# Altium schematic sheet Top.SchDoc
size A4
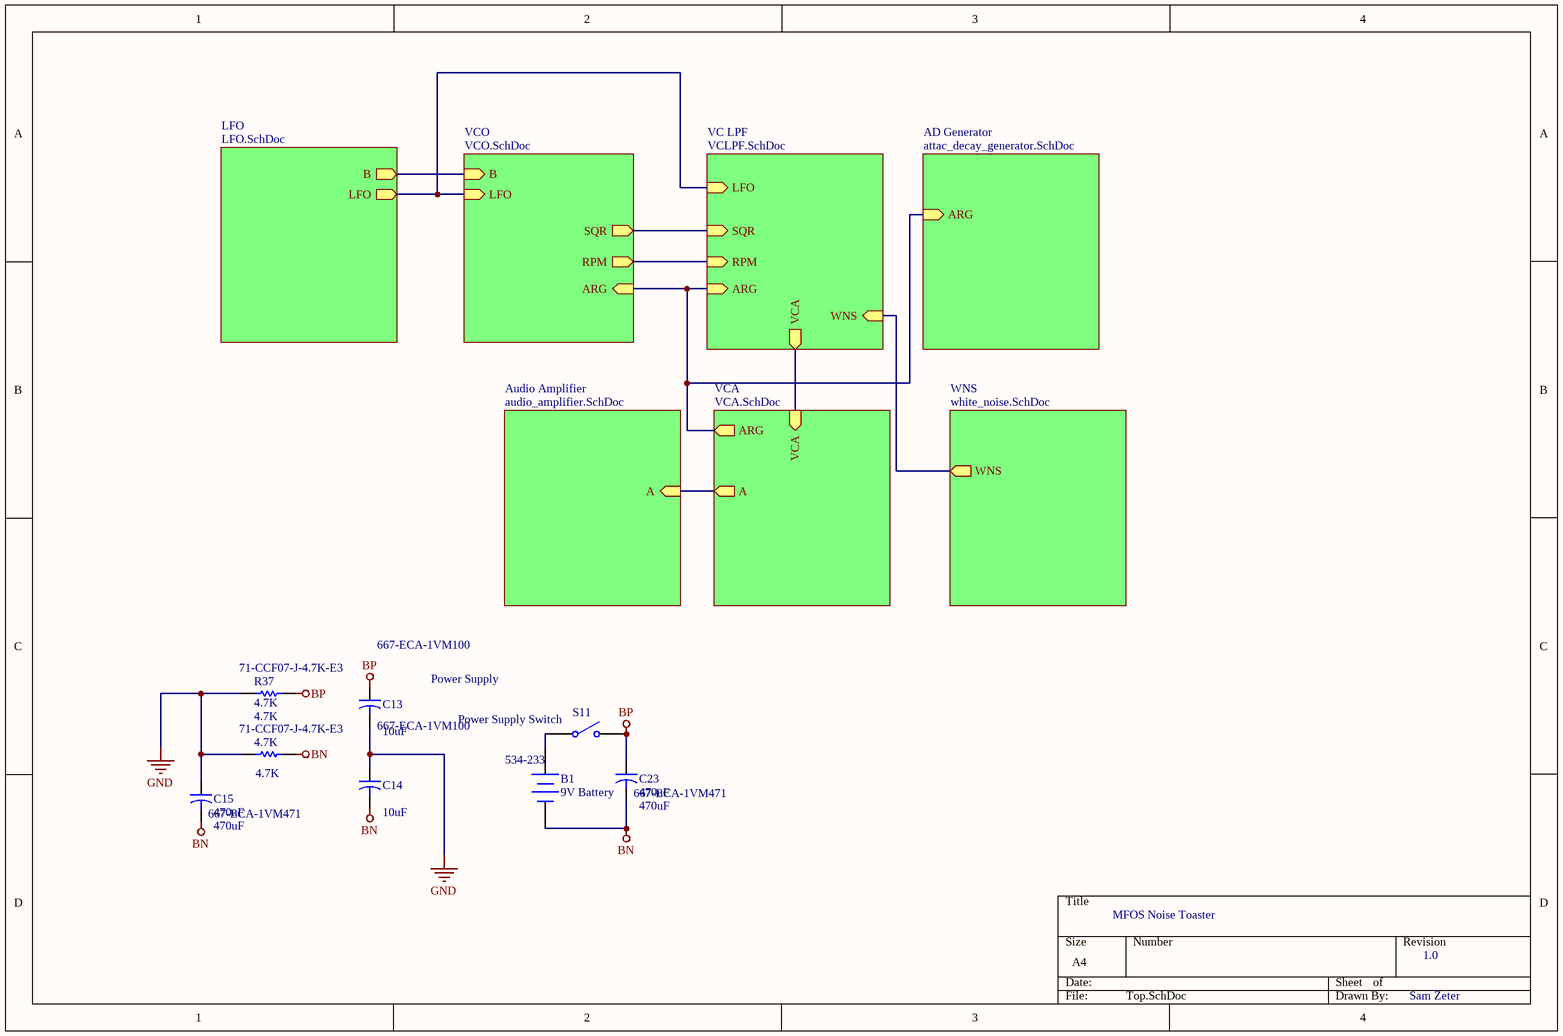
[diagram p0: Top.SchDoc]

## Parts
4.7K  value 4.7K  Supplier Part Number 1: 71-CCF07-J-4.7K-E3  [AXIAL-0.3]  (hidden comment: Res1)
B1  9V Battery  Supplier Part Number 1: 534-233  [BAT-2]
C13  Supplier Part Number 1: 667-ECA-1VM100  [CAPR5-4X5]  (hidden comment: 10uF)
C14  Supplier Part Number 1: 667-ECA-1VM100  [CAPR5-4X5]  (hidden comment: 10uF)
C15  470uF  Supplier Part Number 1: 667-ECA-1VM471  [CAPR5-4X5]
C23  470uF  Supplier Part Number 1: 667-ECA-1VM471  [CAPR5-4X5]
R37  4.7K  Supplier Part Number 1: 71-CCF07-J-4.7K-E3  [AXIAL-0.3]
S11  Power Supply Switch  [SPST-2]

## Sub-sheets
AD Generator = attac_decay_generator.SchDoc: ARG (in)
Audio Amplifier = audio_amplifier.SchDoc: A (in)
LFO = LFO.SchDoc: LFO (out), B (out)
VC LPF = VCLPF.SchDoc: LFO (in), RPM (in), SQR (in), WNS (in), ARG (in), VCA (out)
VCA = VCA.SchDoc: VCA (in), A (out), ARG (out)
VCO = VCO.SchDoc: LFO (in), B (in), SQR (out), RPM (out), ARG (in)
WNS = white_noise.SchDoc: WNS (out)

## Nets
BN: 4.7K.2 B1.2(-) C14.2 C15.2 C23.2
BP: C13.1 C23.1 R37.2 S11.2(NO)
GND: 4.7K.1 C13.2 C14.1 C15.1 R37.1
NetB1_1: B1.1(+) S11.1(COMMON)
(unnamed): sheet VCO/LFO, sheet VC LPF/LFO, sheet LFO/LFO
(unnamed): sheet VCO/B, sheet LFO/B
(unnamed): sheet VCO/SQR, sheet VC LPF/SQR
(unnamed): sheet VCO/RPM, sheet VC LPF/RPM
(unnamed): sheet VCO/ARG, sheet VCA/ARG, sheet VC LPF/ARG, sheet AD Generator/ARG
(unnamed): sheet VCA/VCA, sheet VC LPF/VCA
(unnamed): sheet VCA/A, sheet Audio Amplifier/A
(unnamed): sheet VC LPF/WNS, sheet WNS/WNS

## Notes on the sheet
- Power Supply
- MFOS Noise Toaster
- 1.0
- Sam Zeter

## Library data of the parts
4.7K R37 = Res1: Resistor; Manufacturer: Vishay / Dale; Manufacturer Part Number: CCF074K70JKE36; Power Rating: 250 mW (1/4 W), 500 mW (1/2 W); Resistance: 4.7 kOhms; Temperature Coefficient: 100 PPM / K; Tolerance: 5 %; Voltage Rating: 250 V; Lead Diameter: 0.6 mm; Published: 8-Jun-2000; LatestRevisionDate: 17-Jul-2002; LatestRevisionNote: Re-released for DXP Platform.; PackageReference: AXIAL-0.3; Publisher: Altium Limited; PackageDescription: Axial Device, Thru-Hole; 2 Leads; 0.3 in Pin Spacing; Supplier 1: Mouser; RoHS: RoHS Compliant; Category: Metal Film Resistors - Through Hole; Stock 1: 32326; Pricing 1: 1=0.100, 100=0.040, 1000=0.030, 2000=0.027, 5000=0.025, 10000=0.022, 25000=0.020, 50000=0.018, 100000=0.016 (USD); Diameter: 2.29 mm; Length: 6.22 mm; Operating Temperature Range: - 65 C to + 150 C; Packaging: Reel; Product: Metal Film Resistors - Through Hole; Series: CCF07; Termination Style: Axial; Type: Metal Film Resistors, Industrial; Brand: Vishay / Dale; Standard Pack Qty: 5000; RoHS - Mouser: Y; Minimum Order Quantity: 1; Reeling: True; ComponentLink1URL: http://www.mouser.com/ds/2/427/ccf07-239748.pdf; ComponentLink1Description: http://www.mouser.com/ds/2/427/ccf07-239748.pdf
  R37: Value: 4.7K
B1 = Battery: Multicell Battery; Manufacturer: Keystone Electronics; Manufacturer Part Number: 233; Number of Batteries: 1 Battery; Published: 24-Mar-1999; LatestRevisionDate: 17-Jul-2002; LatestRevisionNote: Re-released for DXP Platform.; PackageReference: BAT-2; Publisher: Altium Limited; PackageDescription: Battery; 2 Leads; Supplier 1: Mouser; RoHS: RoHS Compliant; Category: 9V Battery Snaps & Contacts; Stock 1: 3397; Pricing 1: 1=0.490, 10=0.467, 50=0.374, 100=0.358, 200=0.327, 500=0.312, 1000=0.259, 2500=0.234, 5000=0.226 (USD); Contact Plating: Nickel Plating; Material: Brass; Packaging: Bulk; Product: Battery Snaps; Type: Battery Strap; Battery Cell Size: 9 V; Brand: Keystone Electronics; Standard Pack Qty: 100; RoHS - Mouser: Y; Minimum Order Quantity: 1; Reeling: False; ComponentLink1URL: http://www.mouser.com/ds/2/215/32-234-741101.pdf; ComponentLink1Description: http://www.mouser.com/ds/2/215/32-234-741101.pdf
C13 C14 = Cap2: Capacitor; Manufacturer: Panasonic; Manufacturer Part Number: ECA-1VM100; Tolerance: 20 %; Type: Radial Lead Type; Voltage Rating DC: 35 VDC; Life: 2000 Hour; Ripple Current: 60 mA; Published: 23-Sep-2002; PackageReference: CAPR5-4X5; Publisher: Altium Limited; PackageDescription: Capacitor; 2 Leads; Value: 10uF; Supplier 1: Mouser; RoHS: RoHS Compliant; Category: Aluminum Electrolytic Capacitors - Leaded; Stock 1: 30530; Pricing 1: 1=0.200, 10=0.080, 100=0.055, 500=0.046, 1000=0.041, 2500=0.039, 10000=0.030, 25000=0.028, 50000=0.025 (USD); Capacitance: 10 uF; Diameter: 5 mm; Length: 11 mm; Package / Case: Radial, Can; Packaging: Bulk; Product: General Purpose Electrolytic Capacitors; Series: M; Termination Style: Radial; Brand: Panasonic; Lead Spacing: 2 mm; Lead Style: Straight; Maximum Operating Temperature: + 85 C; Minimum Operating Temperature: - 40 C; Standard Pack Qty: 200; RoHS - Mouser: Y; Minimum Order Quantity: 1; Reeling: False; ComponentLink1URL: http://www.mouser.com/ds/2/315/ABA0000C1047-947484.pdf; ComponentLink1Description: http://www.mouser.com/ds/2/315/ABA0000C1047-947484.pdf
C15 C23 = Cap2: Capacitor; Manufacturer: Panasonic; Manufacturer Part Number: ECA-1VM471; Tolerance: 20 %; Type: Radial Lead Type; Voltage Rating DC: 35 VDC; Dissipation Factor DF: 0.14; Life: 2000 Hour; Ripple Current: 550 mA; Published: 23-Sep-2002; PackageReference: CAPR5-4X5; Publisher: Altium Limited; PackageDescription: Capacitor; 2 Leads; Value: 470uF; Supplier 1: Mouser; RoHS: RoHS Compliant; Category: Aluminum Electrolytic Capacitors - Leaded; Stock 1: 25570; Pricing 1: 1=0.470, 10=0.252, 100=0.187, 500=0.162, 1000=0.138, 2500=0.130, 10000=0.112, 25000=0.110, 50000=0.104 (USD); Capacitance: 470 uF; Diameter: 10 mm; Length: 16 mm; Package / Case: Radial, Can; Packaging: Bulk; Product: General Purpose Electrolytic Capacitors; Series: M; Termination Style: Radial; Brand: Panasonic; Lead Spacing: 5 mm; Lead Style: Straight; Maximum Operating Temperature: + 85 C; Minimum Operating Temperature: - 40 C; Standard Pack Qty: 200; RoHS - Mouser: Y; Minimum Order Quantity: 1; Reeling: False; ComponentLink1URL: http://www.mouser.com/ds/2/315/ABA0000C1047-947484.pdf; ComponentLink1Description: http://www.mouser.com/ds/2/315/ABA0000C1047-947484.pdf
S11 = SW-SPST: Single-Pole, Single-Throw Switch; Published: 24-Mar-1999; LatestRevisionDate: 17-Jul-2002; LatestRevisionNote: Re-released for DXP Platform.; PackageReference: SPST-2; Publisher: Altium Limited; PackageDescription: Switch; 2 Leads; Supplier 1: Mouser; Supplier Part Number 1: 108-MS550K